# EasyEDA Pro project BSPD - 小板.eprj

# Schematic Sheet_1
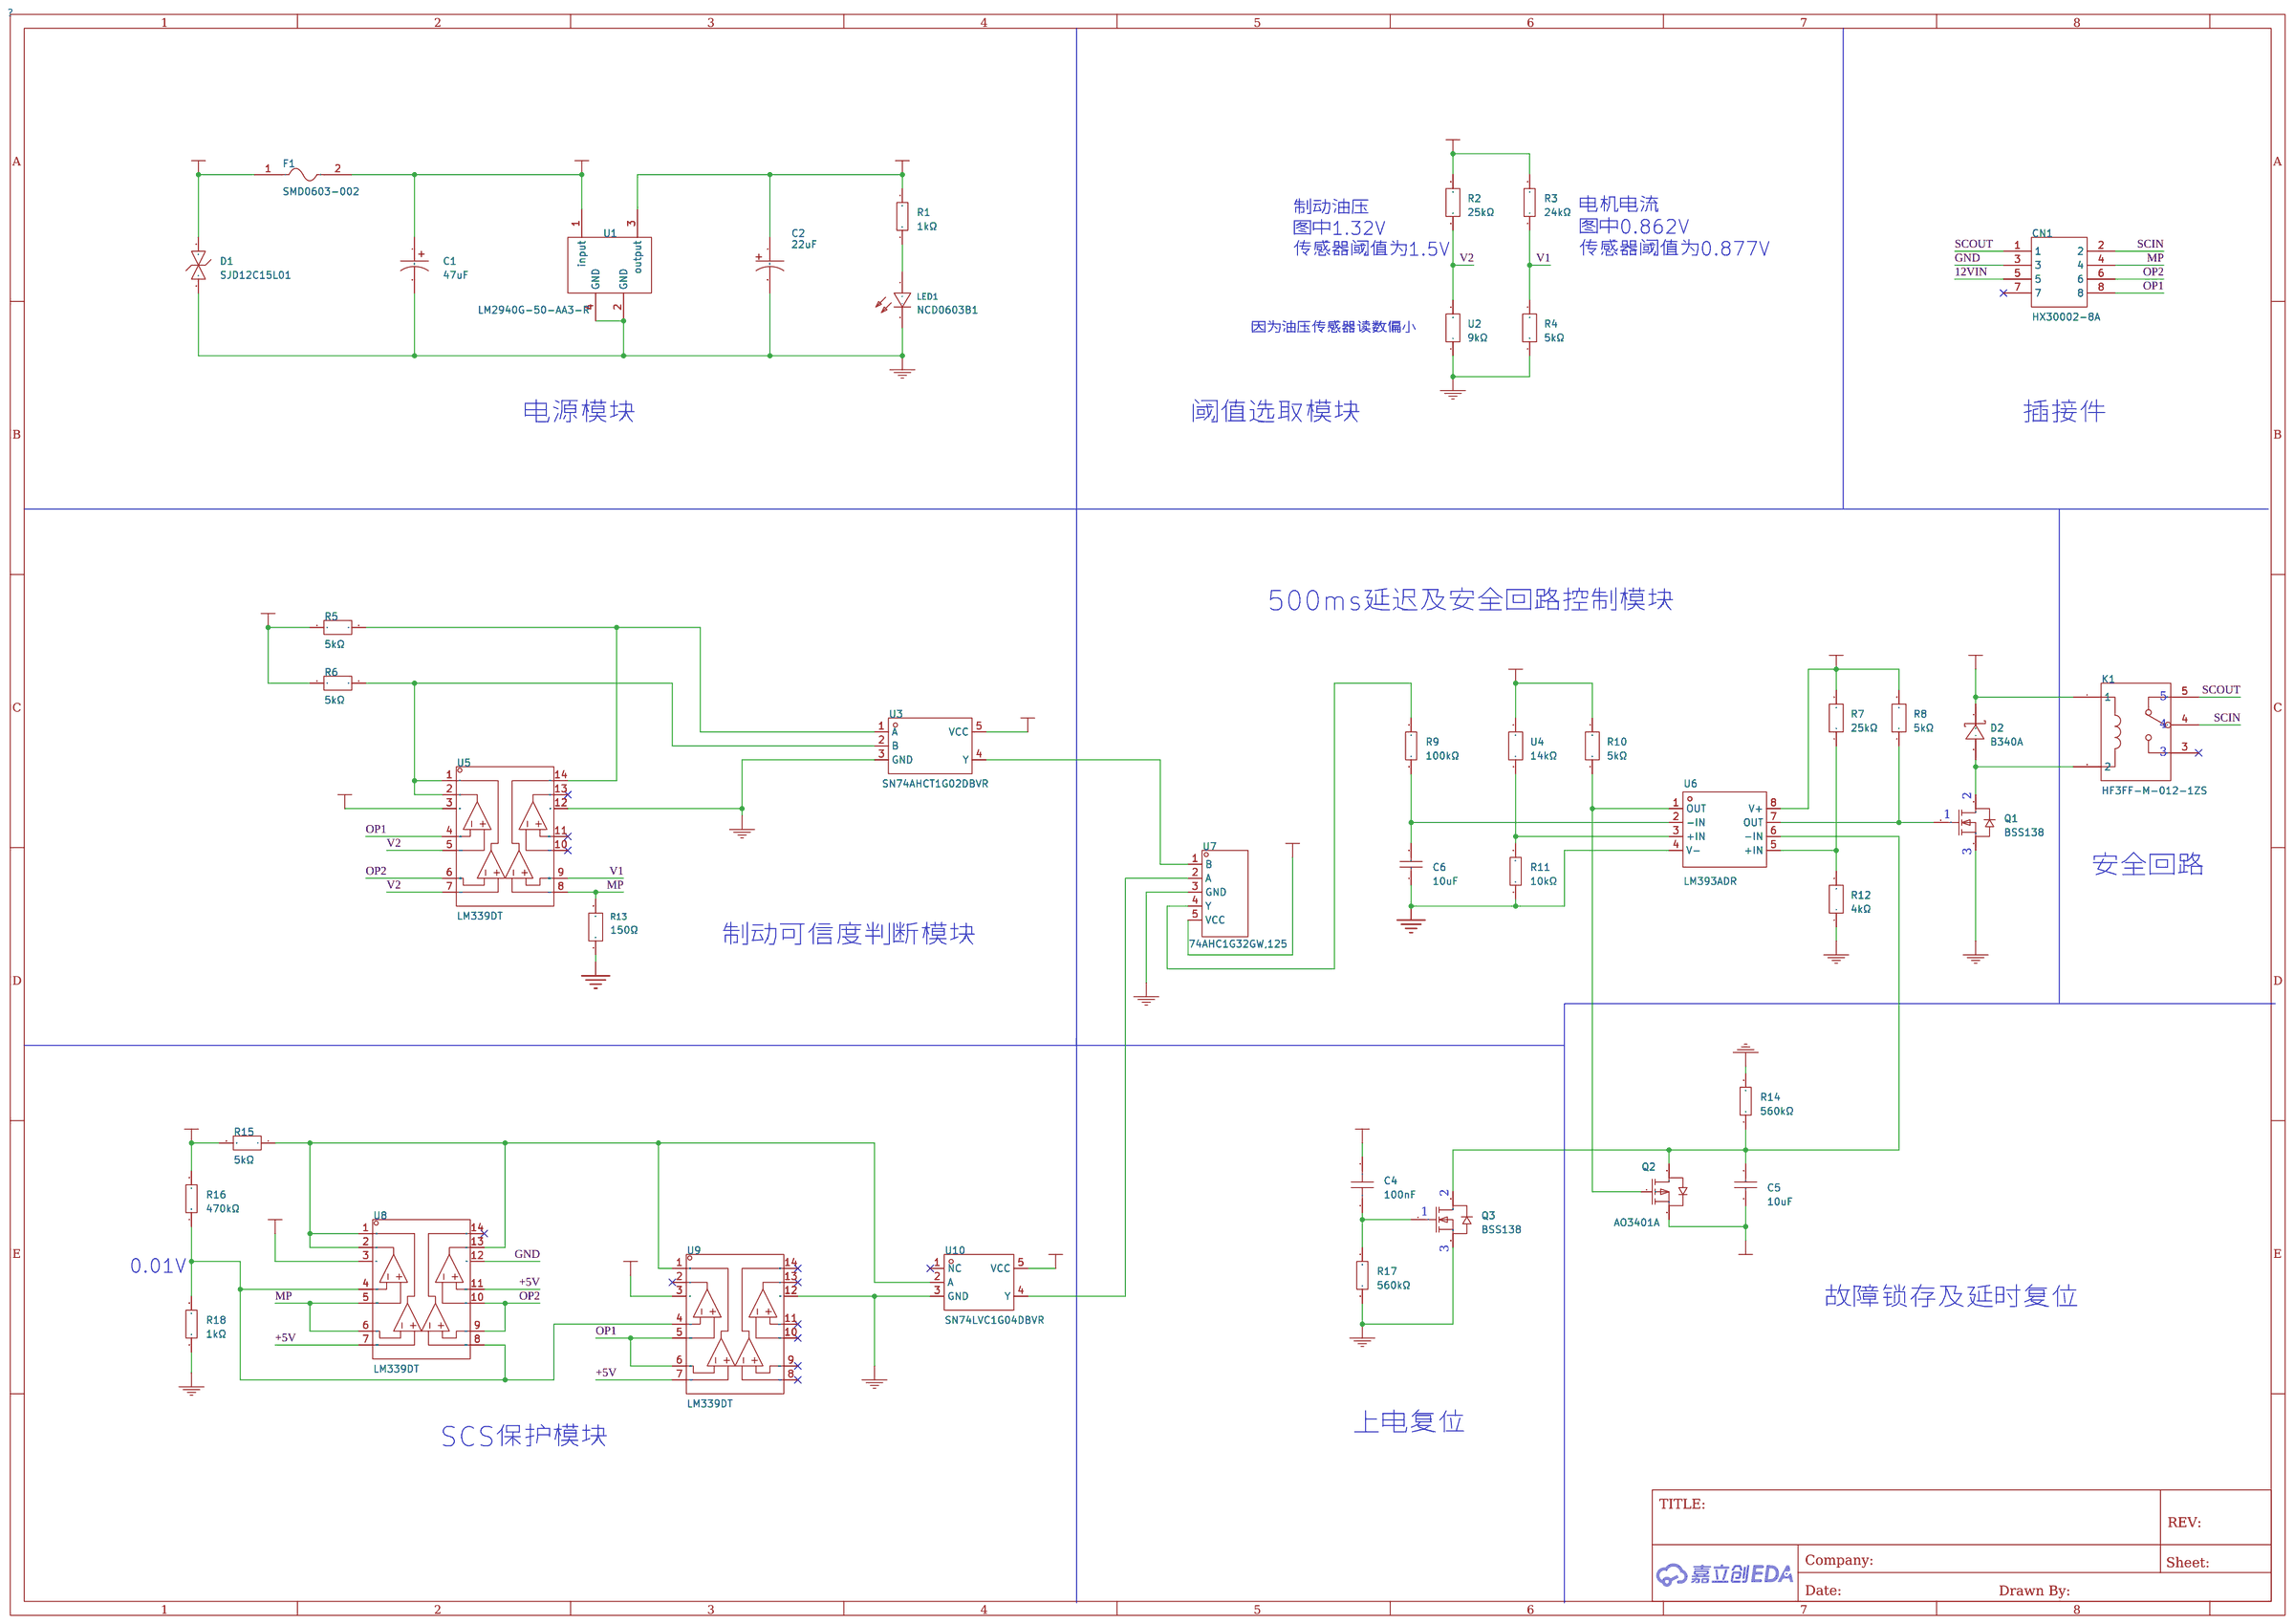
[diagram p0: schematic sheet]

## Parts
C1  47uF  [CAP-SMD_BD8.0-L8.3-W8.3-FD]
C2  22uF  [CAP-SMD_BD6.3-L6.6-W6.6-FD]
C4  100nF  [C0603]
C5  10uF  [C0805]
C6  10uF  [C0805]
CN1  HX30002-8A  [CONN-TH_30002-8A-T1P]
D1  SJD12C15L01  [SOD-123_L2.7-W1.6-LS3.7-BI]
D2  B340A  [SMA_L4.3-W2.6-LS5.1-RD]
F1  SMD0603-002  [F0603]
K1  HF3FF-M-012-1ZS  [RELAY-TH_HF3FF-XX-1ZXX-XXX]
LED1  NCD0603B1  [LED0603-RD]
Q1  BSS138  [SOT-23-3_L2.9-W1.3-P1.90-LS2.4-BR]
Q2  AO3401A  [SOT-23_L2.9-W1.3-P1.90-LS2.4-BR]
Q3  BSS138  [SOT-23-3_L2.9-W1.3-P1.90-LS2.4-BR]
R1  1kΩ  [R0603]
R2  25kΩ  [R0603]
R3  24kΩ  [R0603]
R4  5kΩ  [R0603]
R5  5kΩ  [R0603]
R6  5kΩ  [R0603]
R7  25kΩ  [R0603]
R8  5kΩ  [R0603]
R9  100kΩ  [R0603]
R10  5kΩ  [R0603]
R11  10kΩ  [R0603]
R12  4kΩ  [R0805]
R13  150Ω  [R0603]
R14  560kΩ  [R0603]
R15  5kΩ  [R0603]
R16  470kΩ  [R0603]
R17  560kΩ  [R0603]
R18  1kΩ  [R0603]
U1  LM2940G-50-AA3-R  [SOT-223-4_L6.5-W3.5-P2.30-LS7.0-BR]
U2  9kΩ  [R0805]
U3  SN74AHCT1G02DBVR  [SOT-23-5_L3.0-W1.7-P0.95-LS2.8-BR]
U4  14kΩ  [R0402]
U5  LM339DT  [SOIC-14_L8.7-W3.9-P1.27-LS6.0-BL]
U6  LM393ADR  [SOIC-8_L5.0-W4.0-P1.27-LS6.0-BL]
U7  74AHC1G32GW,125  [SOT-353-5_L2.0-W1.3-P0.65-LS2.1-BR]
U8  LM339DT  [SOIC-14_L8.7-W3.9-P1.27-LS6.0-BL]
U9  LM339DT  [SOIC-14_L8.7-W3.9-P1.27-LS6.0-BL]
U10  SN74LVC1G04DBVR  [SOT-23-5_L3.0-W1.7-P0.95-LS2.8-BR]

## Library data of the parts
C1 = HBW470M1JTR-0810: 容值:47uF;精度:±20%;额定电压:63V;; LCSC Part Name: 47uF ±20% 63V; Supplier Part: C3031616; Manufacturer: lelon(立隆); Supplier Footprint: SMD,D8xL10mm; JLCPCB Part Class: Extended Part; Datasheet: https://atta.szlcsc.com/upload/public/pdf/source/20220826/AE5C81AD789A3503116A80B6D4FBEF01.pdf; Supplier: LCSC; Tolerance: ±20%; Rated Voltage: 63V
C2 = EEHZA1J220XP: 容值:22uF;额定电压:63V;等效串联电阻:80mΩ 100kHz;纹波电流:1.5A 100kHz;工作温度:-55℃~+105℃;类型:-;电容体长度:7.7mm;精度:±20%;电容体直径:6.3mm;脚间距:-;工作寿命:10000hrs 105℃;; LCSC Part Name: 22uF 63V; Supplier Part: C454662; Manufacturer: PANASONIC(松下); Supplier Footprint: SMD,6.3x7.7mm; JLCPCB Part Class: Extended Part; Supplier: LCSC; Rated Voltage: 63V; Equivalent Series Resistance(ESR): 80mΩ 100kHz; Ripple Current: 1.5A 100kHz; Operating Temperature: -55℃~+105℃; L: 7.7mm; Tolerance: ±20%; φD: 6.3mm; Lifetime @ Temp: 10000hrs 105℃
C4 = CC0603KRX7R9BB104: 容值:100nF;精度:±10%;额定电压:50V;材质(温度系数):X7R;; LCSC Part Name: 100nF ±10% 50V; Supplier Part: C14663; Manufacturer: YAGEO(国巨); Supplier Footprint: 0603; JLCPCB Part Class: Basic Part; Datasheet: https://atta.szlcsc.com/upload/public/pdf/source/20180910/C282072_33301C7F631E79921B82A8DAC6BCC5B3.pdf; Supplier: LCSC; Tolerance: ±10%; Voltage Rated: 50V; Temperature Coefficient: X7R
C5 C6 = CL21A106KAYNNNE_C15850: 容值:10uF;精度:±10%;额定电压:25V;材质(温度系数):X5R;; LCSC Part Name: 10uF ±10% 25V; Supplier Part: C15850; Manufacturer: SAMSUNG(三星); Manufacturer Part: CL21A106KAYNNNE; Supplier Footprint: 0805; JLCPCB Part Class: Basic Part; Datasheet: https://atta.szlcsc.com/upload/public/pdf/source/20160103/1457707679302.pdf; Supplier: LCSC; Tolerance: ±10%; Voltage Rated: 25V; Temperature Coefficient: X5R
CN1 = HX30002-8A: 参考系列:-;间距:3mm;插针结构:2x4P;排数:2;每排PIN数:4;行距:3mm;安装方式:-;触头材质:黄铜;; LCSC Part Name: 3mm 2x4P; Supplier Part: C185091; Manufacturer: HX(红星); Supplier Footprint: 插件,P=3mm; JLCPCB Part Class: Extended Part; Datasheet: https://atta.szlcsc.com/upload/public/pdf/source/20180316/D977F4BC65FE6A384A4F595F180FB6F1.pdf; Supplier: LCSC; Pitch: 3mm; Pins Structure: 2x4P; Number of Rows: 2; Number of PINs Per Row: 4; Row Spacing: 3mm; Contact Material: 黄铜
D1 = SJD12C15L01: 反向截止电压(Vrwm):15V;击穿电压(VBR):16.7V;峰值脉冲电流(Ipp)@8/20us:8.2A;钳位电压(Vc)@Ipp:24.4V;; Supplier Part: C78437; Manufacturer: Brightking(君耀电子); Supplier Footprint: SOD-123; JLCPCB Part Class: Extended Part; Datasheet: https://atta.szlcsc.com/upload/public/pdf/source/20160709/1468031891025.pdf; Supplier: LCSC; Reverse Stand-Off Voltage (Vrwm): 15V; Breakdown Voltage (VBR): 16.7V; Peak Pulse Current(Ipp)@8/20us: 8.2A; Clamping Voltage@Ipp: 24.4V
D2 = B340A: 直流反向耐压(Vr):40V;平均整流电流(Io):3A;正向压降(Vf):550mV@3A;; LCSC Part Name: 40V 3A 550mV@3A; Supplier Part: C64982; Manufacturer: MDD; Supplier Footprint: SMA(DO-214AC); JLCPCB Part Class: Extended Part; Datasheet: https://atta.szlcsc.com/upload/public/pdf/source/20230314/FEC98C79C2B2FE8CB6E84FEE53FCCA40.pdf; Supplier: LCSC; Reverse Voltage (Vr): 40V; Average Rectified Current (Io): 3A; Forward Voltage (Vf@If): 550mV@3A
F1 = SMD0603-002: 30V,0.02A; LCSC Part Name: 20mA,30V; Supplier Part: C3646886; Manufacturer: 台湾陆海; Supplier Footprint: 0603; JLCPCB Part Class: Extended Part; Datasheet: https://atta.szlcsc.com/upload/public/pdf/source/20230404/20B4F423E9D21310C61C06C0FA62271A.pdf; Supplier: LCSC
K1 = HF3FF-M-012-1ZS: 引脚数:5;线圈电压:12V;触点形式:一组转换:1C(单刀双掷-转换);触点容量(电阻负载):-;触点材料:AgSnO2;; LCSC Part Name: 12V继电器 单刀双掷 停产; Supplier Part: C190459; Manufacturer: HF(宏发); Supplier Footprint: 插件,15.2x19mm; JLCPCB Part Class: Extended Part; Datasheet: https://atta.szlcsc.com/upload/public/pdf/source/20180404/C190459_D8DB0A982CC080BEC67C32A687C75363.pdf; Supplier: LCSC; Pin Number: 5; Coil Voltage: 12V; Coil Rated Power: 450mW; Contact Form: 一组转换:1C(单刀双掷-转换); Coil Resistance: 320Ω; Maximum Switching Current: 30V@DC; Maximum Switching Voltage: 15A; Operate Time: 10ms; Release Time: 10ms; Coil Type: 非极化-单线圈; Contact Resistance: 100mΩ; Contact Material: AgSnO2; Operating Temperature: -40℃~+85℃
LED1 = NCD0603B1: 发光颜色:蓝灯;; LCSC Part Name: 蓝灯; Supplier Part: C84266; Manufacturer: 国星光电; Supplier Footprint: 0603; JLCPCB Part Class: 扩展库; Datasheet: https://atta.szlcsc.com/upload/public/pdf/source/20200820/C84266_6A3CDBEFA72C6CAD68EDA53474ADAE6C.pdf; Supplier: LCSC; Emitted Color: 蓝灯
Q1 Q3 = BSS138_C78284: 类型:N沟道;漏源电压(Vdss):50V;连续漏极电流(Id):220mA;功率(Pd):360mW;导通电阻(RDS(on)@Vgs,Id):3.5Ω@10V,220mA;; LCSC Part Name: N沟道 50V 220mA; Supplier Part: C78284; Manufacturer: CJ(江苏长电/长晶); Supplier Footprint: SOT-23; JLCPCB Part Class: Extended Part; Datasheet: https://atta.szlcsc.com/upload/public/pdf/source/20160713/1468379865905.pdf; Supplier: LCSC; Type: N沟道; Drain Source Voltage (Vdss): 50V; Continuous Drain Current (Id): 220mA; Power Dissipation (Pd): 360mW; Drain Source On Resistance (RDS(on)@Vgs,Id): 3.5Ω@10V,220mA; Gate Threshold Voltage (Vgs(th)@Id): 1.5V@1mA
Q2 = AO3401A_C347476: Supplier Part: C347476; Manufacturer: UMW(广东友台半导体); Supplier Footprint: SOT-23; JLCPCB Part Class: Extended Part; Datasheet: https://atta.szlcsc.com/upload/public/pdf/source/20190827/C347476_6CCC01FEC3E3D166C83BA0E415FD2056.pdf; Supplier: LCSC
R1 R18 = 0603WAF1001T5E: 电阻类型:厚膜电阻;阻值:1kΩ;精度:±1%;功率:100mW;; LCSC Part Name: 1kΩ ±1% 100mW; Supplier Part: C21190; Manufacturer: UNI-ROYAL(厚声); Supplier Footprint: 0603; JLCPCB Part Class: Basic Part; Datasheet: https://atta.szlcsc.com/upload/public/pdf/source/20200306/C422600_1E6D84923E4A46A82E41ADD87F860B5C.pdf; Supplier: LCSC; Type: 厚膜电阻; Tolerance: ±1%; Power(Watts): 100mW; Temperature Coefficient: ±100ppm/℃; Overload Voltage (Max): 75V; Operating Temperature Range: -55℃~+155℃
R2 R7 = AR03BTCX2502: 电阻类型:薄膜电阻;阻值:25kΩ;精度:±0.1%;功率:100mW;; LCSC Part Name: 25kΩ ±0.1% 100mW; Supplier Part: C2828637; Manufacturer: Viking(光颉); Supplier Footprint: 0603; JLCPCB Part Class: Extended Part; Datasheet: https://atta.szlcsc.com/upload/public/pdf/source/20211009/C2828637_E2017FEC9B0D6FD586360A50ABE90B69.pdf; Supplier: LCSC; Type: 薄膜电阻; Tolerance: ±0.1%; Power(Watts): 100mW; Temperature Coefficient: ±25ppm/℃; Overload Voltage (Max): 50V; Operating Temperature Range: -55℃~+155℃
R3 = 0603WAF2402T5E: 电阻类型:厚膜电阻;阻值:24kΩ;精度:±1%;功率:100mW;温度系数:±100ppm/℃;; LCSC Part Name: 厚膜电阻 24kΩ ±1% 100mW; Supplier Part: C23352; Manufacturer: UNI-ROYAL(厚声); Supplier Footprint: 0603; JLCPCB Part Class: 基础库; Datasheet: https://atta.szlcsc.com/upload/public/pdf/source/20200306/C422600_1E6D84923E4A46A82E41ADD87F860B5C.pdf; Supplier: LCSC; Type: 厚膜电阻; Tolerance: ±1%; Power(Watts): 100mW; Temperature Coefficient: ±100ppm/℃; Overload Voltage (Max): 75V; Operating Temperature Range: -55℃~+155℃
R4-R6 R8 R10 R15 = AR03BTCX5001: 电阻类型:薄膜电阻;阻值:5kΩ;精度:±0.1%;功率:100mW;; LCSC Part Name: 5kΩ ±0.1% 100mW; Supplier Part: C2828621; Manufacturer: Viking(光颉); Supplier Footprint: 0603; JLCPCB Part Class: Extended Part; Datasheet: https://atta.szlcsc.com/upload/public/pdf/source/20211009/C2828621_7F88408CB1D09DFC08036051E0A6050B.pdf; Supplier: LCSC; Type: 薄膜电阻; Tolerance: ±0.1%; Power(Watts): 100mW; Temperature Coefficient: ±25ppm/℃; Overload Voltage (Max): 50V; Operating Temperature Range: -55℃~+155℃
R9 = 0603WAF1003T5E: 电阻类型:厚膜电阻;阻值:100kΩ;精度:±1%;功率:100mW;; LCSC Part Name: 100kΩ ±1% 100mW; Supplier Part: C25803; Manufacturer: UNI-ROYAL(厚声); Supplier Footprint: 0603; JLCPCB Part Class: Basic Part; Datasheet: https://atta.szlcsc.com/upload/public/pdf/source/20200306/C422600_1E6D84923E4A46A82E41ADD87F860B5C.pdf; Supplier: LCSC; Type: 厚膜电阻; Tolerance: ±1%; Power(Watts): 100mW; Temperature Coefficient: ±100ppm/℃; Overload Voltage (Max): 75V; Operating Temperature Range: -55℃~+155℃
R11 = 0603WAF1002T5E: 电阻类型:厚膜电阻;阻值:10kΩ;精度:±1%;功率:100mW;; LCSC Part Name: 厚膜电阻 10kΩ ±1% 100mW; Supplier Part: C25804; Manufacturer: UNI-ROYAL(厚声); Supplier Footprint: 0603; JLCPCB Part Class: Basic Part; Datasheet: https://atta.szlcsc.com/upload/public/pdf/source/20200306/C422600_1E6D84923E4A46A82E41ADD87F860B5C.pdf; Supplier: LCSC; Type: 厚膜电阻; Tolerance: ±1%; Power(Watts): 100mW; Temperature Coefficient: ±100ppm/℃; Overload Voltage (Max): 75V; Operating Temperature Range: -55℃~+155℃
R12 = ARG05FTC4001N: 电阻类型:薄膜电阻;阻值:4kΩ;精度:±1%;功率:125mW;; LCSC Part Name: 4kΩ ±1% 125mW; Supplier Part: C2828855; Manufacturer: Viking(光颉); Supplier Footprint: 0805; JLCPCB Part Class: Extended Part; Datasheet: https://atta.szlcsc.com/upload/public/pdf/source/20211009/C2828855_D9C62846AF9CFE91EEAE1DDE47EE8653.pdf; Supplier: LCSC; Type: 薄膜电阻; Tolerance: ±1%; Power(Watts): 125mW; Temperature Coefficient: ±25ppm/℃; Overload Voltage (Max): 150V; Operating Temperature Range: -55℃~+155℃
R13 = PTFR0603B150RN9: 电阻类型:薄膜电阻;阻值:150Ω;精度:±0.1%;功率:100mW;温度系数:±10ppm/℃;; LCSC Part Name: 薄膜电阻 150Ω ±0.1% 100mW; Supplier Part: C2692872; Manufacturer: RESI(开步睿思）; Supplier Footprint: 0603; JLCPCB Part Class: Extended Part; Datasheet: https://atta.szlcsc.com/upload/public/pdf/source/20210312/C2692860_0B6649DBA3C867366D8AF92C78953B08.pdf; Supplier: LCSC; Type: 薄膜电阻; Tolerance: ±0.1%; Power(Watts): 100mW; Temperature Coefficient: ±10ppm/℃; Overload Voltage (Max): 100V; Operating Temperature Range: -55℃~+125℃
R14 R17 = 0603WAF5603T5E: 电阻类型:厚膜电阻;阻值:560kΩ;精度:±1%;功率:100mW;; LCSC Part Name: 560kΩ ±1% 100mW; Supplier Part: C23203; Manufacturer: UNI-ROYAL(厚声); Supplier Footprint: 0603; JLCPCB Part Class: Basic Part; Datasheet: https://atta.szlcsc.com/upload/public/pdf/source/20200306/C422600_1E6D84923E4A46A82E41ADD87F860B5C.pdf; Supplier: LCSC; Type: 厚膜电阻; Tolerance: ±1%; Power(Watts): 100mW; Temperature Coefficient: ±100ppm/℃; Overload Voltage (Max): 75V; Operating Temperature Range: -55℃~+155℃
R16 = 0603WAF4703T5E: 电阻类型:厚膜电阻;阻值:470kΩ;精度:±1%;功率:100mW;; LCSC Part Name: 470kΩ ±1% 100mW; Supplier Part: C23178; Manufacturer: UNI-ROYAL(厚声); Supplier Footprint: 0603; JLCPCB Part Class: 基础库; Datasheet: https://atta.szlcsc.com/upload/public/pdf/source/20200306/C422600_1E6D84923E4A46A82E41ADD87F860B5C.pdf; Supplier: LCSC; Type: 厚膜电阻; Tolerance: ±1%; Power(Watts): 100mW; Temperature Coefficient: ±100ppm/℃; Overload Voltage (Max): 75V; Operating Temperature Range: -55℃~+155℃
U1 = LM2940G-50-AA3-R: 输出类型:固定;输出极性:正;输出通道数:1;最大输入电压:26V;输出电压:5V;压差:800mV@(1A);输出电流:1A;电源纹波抑制比(PSRR):72dB@(120Hz);; LCSC Part Name: 正 Vin=26V Vout=5V 1A 72dB@(120Hz); Supplier Part: C71094; Manufacturer: UTC(友顺); Supplier Footprint: SOT-223-4; JLCPCB Part Class: Extended Part; Datasheet: https://atta.szlcsc.com/upload/public/pdf/source/20160416/1460799393051.pdf; Supplier: LCSC; Output Type: 固定; Output Polarity: 正; Number of Outputs: 1; Maximum Input Voltage: 26V; Output Voltage: 5V; Dropout Voltage: 800mV@(1A); Output Current: 1A; Power Supply Rejection Ratio (PSRR): 72dB@(120Hz)
U2 = ARG05BTC9001N: 电阻类型:薄膜电阻;阻值:9kΩ;精度:±0.1%;功率:125mW;; LCSC Part Name: 9kΩ ±0.1% 125mW; Supplier Part: C2828721; Manufacturer: Viking(光颉); Supplier Footprint: 0805; JLCPCB Part Class: Extended Part; Datasheet: https://atta.szlcsc.com/upload/public/pdf/source/20211009/C2828721_BEDCD57BD0F711BBAFC7B17F6BE665AD.pdf; Supplier: LCSC; Type: 薄膜电阻; Tolerance: ±0.1%; Power(Watts): 125mW; Temperature Coefficient: ±25ppm/℃; Overload Voltage (Max): 150V; Operating Temperature Range: -55℃~+155℃
U3 = SN74AHCT1G02DBVR: 逻辑电路的归属系列:74AHCT;逻辑类型:或非门;; LCSC Part Name: 或非门; Supplier Part: C163710; Manufacturer: TI(德州仪器); Supplier Footprint: SOT-23-5; JLCPCB Part Class: Extended Part; Datasheet: https://atta.szlcsc.com/upload/public/pdf/source/20180329/C163710_AF396B66C9170E2FC25D4E514CBC82E3.pdf; Supplier: LCSC; Series: 74AHCT; Logic Gate Type: 或非门
U4 = SCR0402F14K: 阻值:14kΩ;精度:±1%;; LCSC Part Name: 14kΩ ±1%; Supplier Part: C3015834; Manufacturer: VO(翔胜); Supplier Footprint: 0402; JLCPCB Part Class: Extended Part; Datasheet: https://atta.szlcsc.com/upload/public/pdf/source/20220513/247AF9639BA21CF93567DC289CCC6A22.pdf; Supplier: LCSC; Tolerance: ±1%
U5 U8 U9 = LM339DT: 比较器组数:4;电源电压:2V ~ 32V, ±1V ~ 16V;各通道供电电流:2.5mA;输出类型:CMOS, DTL, ECL, MOS, Open-Collector, TTL;传播延迟:-;; Supplier Part: C71036; Manufacturer: ST(意法半导体); Supplier Footprint: SO14; JLCPCB Part Class: Extended Part; Datasheet: https://atta.szlcsc.com/upload/public/pdf/source/20160408/1460100649765.pdf; Supplier: LCSC; Number of Elements: 4; Supply Voltage（Single）: 2V ~ 32V, ±1V ~ 16V; Iq per channel (Typ): 2.5mA; Output Type: CMOS, DTL, ECL, MOS, Open-Collector, TTL; Operating Temperature: 0°C ~ 70°C
U6 = LM393ADR_C30394: 比较器组数:2;电源电压:2V~36V,±1V~18V;各通道供电电流:2.5mA;输出类型:CMOS, MOS, Open-Collector, TTL;传播延迟:-;; Supplier Part: C30394; Manufacturer: TI(德州仪器); Supplier Footprint: SOIC-8-150mil; JLCPCB Part Class: Extended Part; Datasheet: https://atta.szlcsc.com/upload/public/pdf/source/20140425/1457707046713.pdf; Supplier: LCSC; Number of Elements: 2; Supply Voltage（Single）: 2V~36V,±1V~18V; Iq per channel (Typ): 2.5mA; Output Type: CMOS, MOS, Open-Collector, TTL; Operating Temperature: 0°C ~ 70°C
U7 = 74AHC1G32GW,125: 逻辑类型:或门;通道数:1;电源电压:2V~5.5V;静态电流(最大值):1uA;最大传播延迟:7.5ns@5V,50pF;; LCSC Part Name: 或门; Supplier Part: C12489; Manufacturer: Nexperia(安世); Supplier Footprint: SOT-353; JLCPCB Part Class: Extended Part; Datasheet: https://atta.szlcsc.com/upload/public/pdf/source/20220815/B1BE7544FCE627AC6685637B8BBDD300.pdf; Supplier: LCSC; Series: 74AHC; Logic Gate Type: 或门; Number of Channels: 1; Supply Voltage: 2V~5.5V; Quiescent Current (Max): 1uA; Sink Current: 8mA; Source Current: 8mA; High Level Range (VIH): 1.5V~3.85V; Low Level Range (VIL): 500mV~1.65V; Propagation Delay Time: 7.5ns@5V,50pF; Operating Temperature: -40℃~+125℃
U10 = SN74LVC1G04DBVR: LCSC Part Name: 门极和反相器; Supplier Part: C434067; Manufacturer: UMW(广东友台半导体); Supplier Footprint: SOT-23-5; JLCPCB Part Class: Extended Part; Datasheet: https://atta.szlcsc.com/upload/public/pdf/source/20190930/C434067_C317521F7851E57339C1FB91FCB4BA19.pdf; Supplier: LCSC

## Nets
12VIN: CN1.5 D1.2 F1.1
+5V: C2.1 C4.2 C5.1 Q2.2(S) R1.2 R2.2 R3.2 R5.2 R6.2 R7.2 R8.2 R10.2 R15.2 R16.2 U1.3(output) U3.5(VCC) U4.2 U5.3(VDD) U6.8(V+) U7.5(VCC) U8.3(VDD) U8.7(Non-inverting input2) U8.11(Non-inverting input4) U9.3(VDD) U9.7(Non-inverting input2) U10.5(VCC)
+12V: C1.1 D2.1(K) F1.2 K1.1 U1.1(input)
GND: C1.2 C2.2 C6.1 CN1.3 D1.1 LED1.1(-) Q1.2(S) Q3.2(S) R4.2 R11.1 R12.1 R13.1 R14.2 R17.1 R18.1 U1.2(GND) U1.4(GND) U2.1 U3.3(GND) U5.12(GND) U6.4(V-) U7.3(GND) U8.12(GND) U9.12(GND) U10.3(GND)
V1: R3.1 R4.1 U5.9(Non-inverting input3)
V2: R2.1 U2.2 U5.5(Non-inverting input1) U5.7(Non-inverting input2)
MP: CN1.4 R13.2 U5.8(Inverting input3) U8.5(Non-inverting input1) U8.6(Inverting input2)
OP1: CN1.8 U5.4(Inverting input1) U9.5(Non-inverting input1) U9.6(Inverting input2)
OP2: CN1.6 U5.6(Inverting input2) U8.9(Non-inverting input3) U8.10(Inverting input4)
SCIN: CN1.2 K1.4
SCOUT: CN1.1 K1.5
$1N80: LED1.2(+) R1.1
$1N251: R6.1 U3.2(B) U5.1(OUTPUT2) U5.2(OUTPUT1)
$1N317: U7.2(A) U10.4(Y)
$1N570: D2.2(A) K1.2 Q1.3(D)
$1N660: C4.1 Q3.1(G) R17.2
$1N1894: R5.1 U3.1(A) U5.14(OUTPUT3)
$1N2001: U3.4(Y) U7.1(B)
$1N4280: Q1.1(G) R8.1 U6.7(OUT)
$1N5487: R11.2 U4.1 U6.3(+IN)
$1N7549: R7.1 R12.2 U6.5(+IN)
$1N7655: Q2.1(G) R10.1 U6.1(OUT)
$1N14250: R15.1 U8.1(OUTPUT2) U8.2(OUTPUT1) U8.13(OUTPUT4) U9.1(OUTPUT2) U10.2(A)
$1N14254: R9.2 U7.4(Y)
$1N35655: R16.1 R18.2 U8.4(Inverting input1) U8.8(Inverting input3) U9.4(Inverting input1)
$1N35960: C5.2 Q2.3(D) Q3.3(D) R14.1 U6.6(-IN)
$1N36060: C6.2 R9.1 U6.2(-IN)

Not connected (* = marked no-connect by the designer): CN1 7*; K1 3*; U5 10(Inverting input4)* 11(Non-inverting input4)* 13(OUTPUT4)*; U8 14(OUTPUT3)*; U9 2(OUTPUT1)* 8(Inverting input3)* 9(Non-inverting input3)* 10(Inverting input4)* 11(Non-inverting input4)* 13(OUTPUT4)* 14(OUTPUT3)*; U10 1(NC)*

## Notes on the sheet
- 制动油压
  图中1.32V
  传感器阈值为1.5V
- 电机电流
  图中0.862V
  传感器阈值为0.877V
- 因为油压传感器读数偏小
- 电源模块
- 阈值选取模块
- 插接件
- 500ms延迟及安全回路控制模块
- 5
- 4
- 3
- 2
- 1
- 3
- 安全回路
- 制动可信度判断模块
- 2
- 1
- 3
- 0.01V
- 故障锁存及延时复位
- 上电复位
- SCS保护模块

# Board PCB1
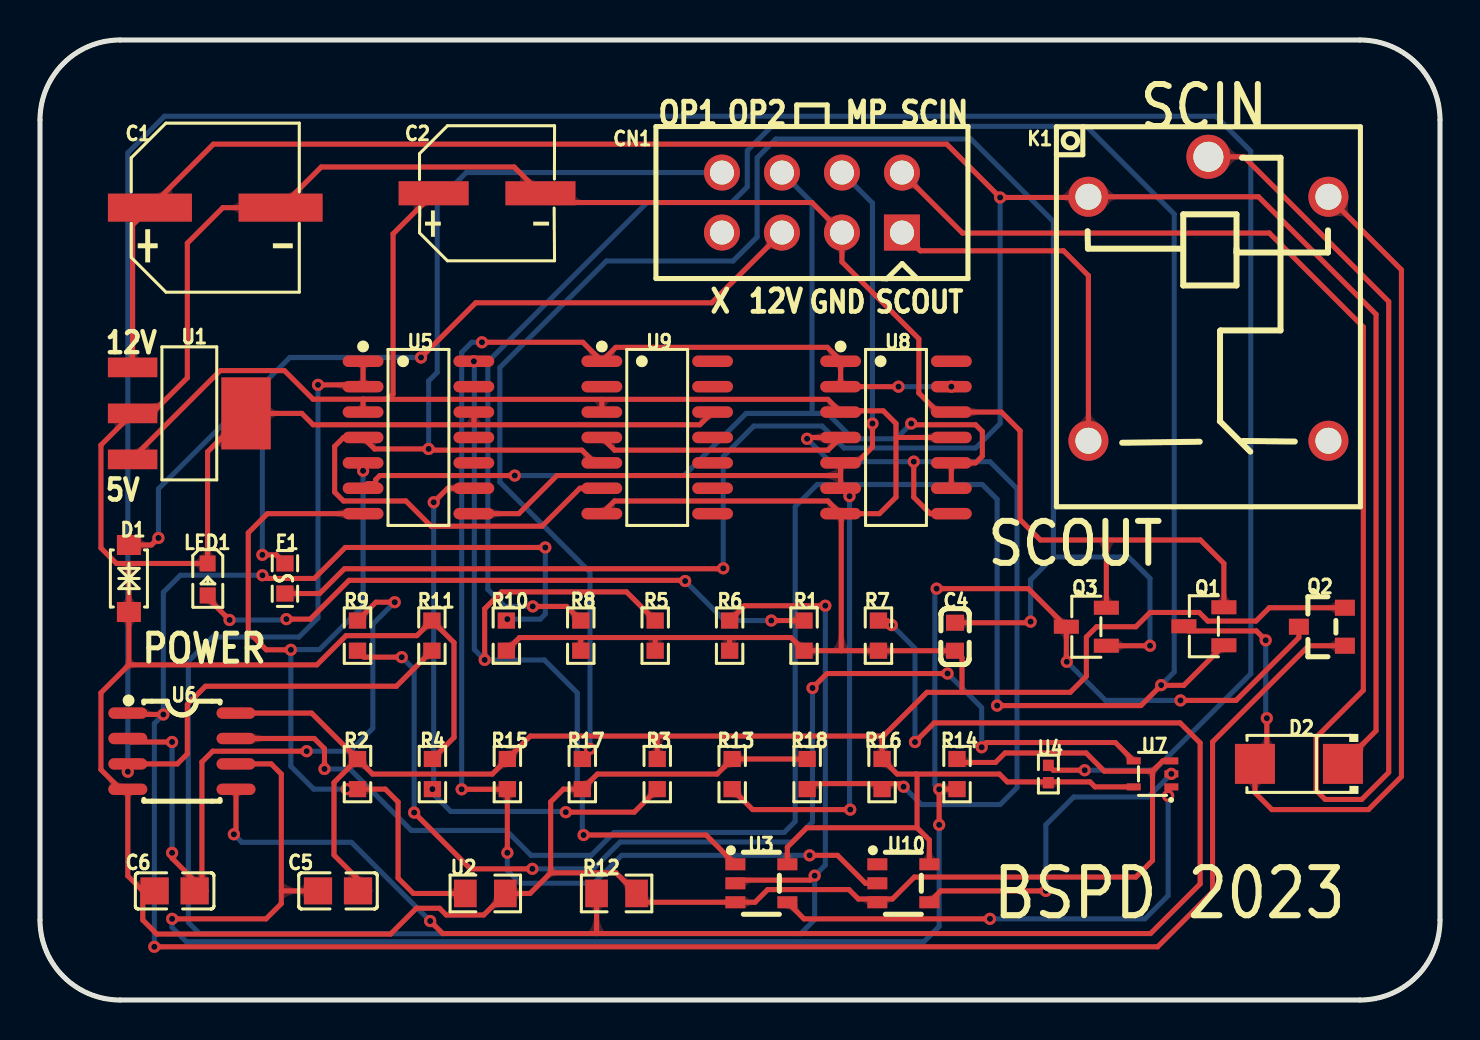
[diagram p1: board, top side]
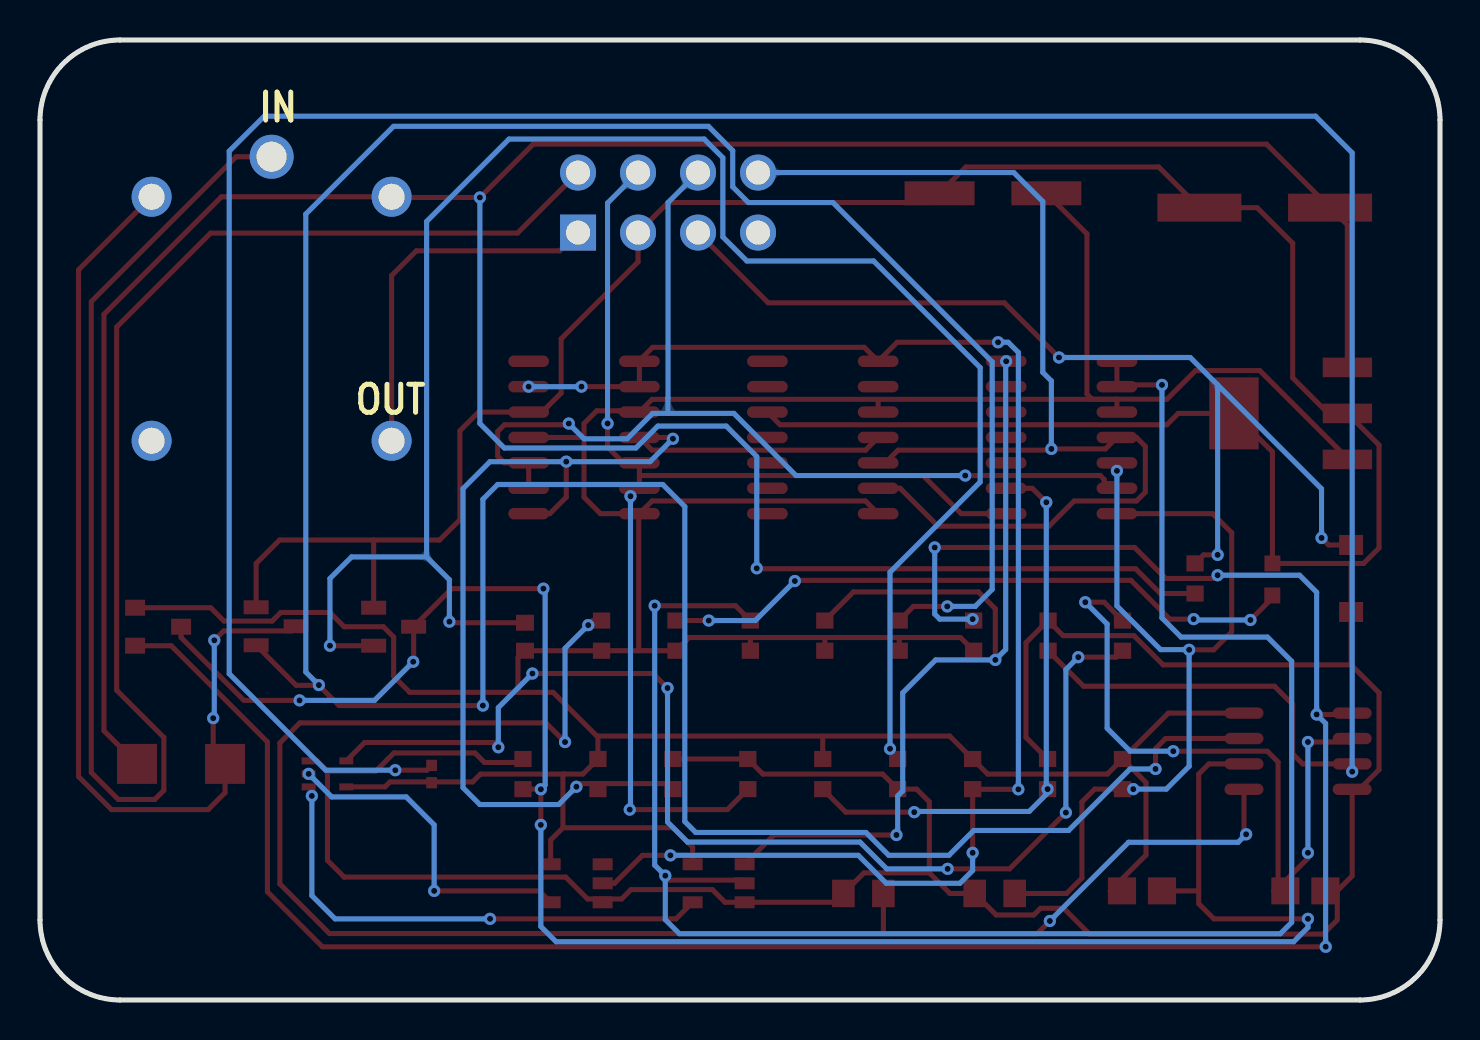
[diagram p2: board, bottom side, seen from below]

Outline 70 x 48 mm; copper layers: Top Layer, Bottom Layer. Coordinates in mm from the lower left corner of the outline.
Outline path: 0,44 0,4 arc(1.17,1.17) 4,0 66,0 arc(68.83,1.17) 70,4 70,44 arc(68.83,46.83) 66,48 4,48 arc(1.17,46.83) 0,44
Stack: Top Layer 0.035mm / Dielectric1 1.51mm FR4 er 4.5 / Bottom Layer 0.035mm

## Design rules (mm)
template: JLCPCB Capability(Two Layers Board)
spacing copperThickness1oz (default): track to track 0.102, other pairs 0.152 to 0.3
spacing copperThickness2oz: track to track 0.203, other pairs 0.152 to 0.3
track width copperThickness1oz (default): min 0.127, default 0.254, max 2.54
track width copperThickness2oz: min 0.203, default 0.254, max 2.54
differential pair differentialPair (default): width min 0.127, default 0.254, max 2.54; gap min 0.152, default 0.152
via viaSize (default): diameter min 0.5, default 0.61, max 10; hole min 0.3, default 0.305, max 6.3

## Placement (name value [footprint] x y rotation side)
C1  47uF  [CAP-SMD_BD8.0-L8.3-W8.3-FD]  8.76 39.62 0 top
C2  22uF  [CAP-SMD_BD6.3-L6.6-W6.6-FD]  22.35 40.34 0 top
C4  100nF  [C0603]  45.75 18.16 270 top
C5  10uF  [C0805]  14.9 5.45 180 top
C6  10uF  [C0805]  6.73 5.45 0 top
CN1  HX30002-8A  [CONN-TH_30002-8A-T1P]  38.6 39.87 180 top
D1  SJD12C15L01  [SOD-123_L2.7-W1.6-LS3.7-BI]  4.44 21.08 90 top
D2  B340A  [SMA_L4.3-W2.6-LS5.1-RD]  62.95 11.81 180 top
F1  SMD0603-002  [F0603]  12.25 21.08 270 top
K1  HF3FF-M-012-1ZS  [RELAY-TH_HF3FF-XX-1ZXX-XXX]  58.42 35.06 270 top
LED1  NCD0603B1  [LED0603-RD]  8.38 21.03 270 top
Q1  BSS138  [SOT-23-3_L2.9-W1.3-P1.90-LS2.4-BR]  58.19 18.69 0 top
Q2  AO3401A  [SOT-23_L2.9-W1.3-P1.90-LS2.4-BR]  64.09 18.66 0 top
Q3  BSS138  [SOT-23-3_L2.9-W1.3-P1.90-LS2.4-BR]  52.32 18.66 0 top
R1  1kΩ  [R0603]  38.2 18.22 270 top
R2  25kΩ  [R0603]  15.88 11.3 90 top
R3  24kΩ  [R0603]  30.86 11.3 90 top
R4  5kΩ  [R0603]  19.62 11.3 90 top
R5  5kΩ  [R0603]  30.76 18.22 270 top
R6  5kΩ  [R0603]  34.48 18.22 270 top
R7  25kΩ  [R0603]  41.92 18.22 270 top
R8  5kΩ  [R0603]  27.04 18.22 270 top
R9  100kΩ  [R0603]  15.88 18.22 270 top
R10  5kΩ  [R0603]  23.32 18.22 270 top
R11  10kΩ  [R0603]  19.6 18.22 270 top
R12  4kΩ  [R0805]  28.83 5.33 180 top
R13  150Ω  [R0603]  34.61 11.3 270 top
R14  560kΩ  [R0603]  45.85 11.3 90 top
R15  5kΩ  [R0603]  23.37 11.3 90 top
R16  470kΩ  [R0603]  42.1 11.3 90 top
R17  560kΩ  [R0603]  27.12 11.3 90 top
R18  1kΩ  [R0603]  38.36 11.3 270 top
U1  LM2940G-50-AA3-R  [SOT-223-4_L6.5-W3.5-P2.30-LS7.0-BR]  7.47 29.33 180 top
U2  9kΩ  [R0805]  22.27 5.33 180 top
U3  SN74AHCT1G02DBVR  [SOT-23-5_L3.0-W1.7-P0.95-LS2.8-BR]  36.07 5.84 180 top
U4  14kΩ  [R0402]  50.42 11.3 270 top
U5  LM339DT  [SOIC-14_L8.7-W3.9-P1.27-LS6.0-BL]  18.92 28.13 270 top
U6  LM393ADR  [SOIC-8_L5.0-W4.0-P1.27-LS6.0-BL]  7.1 12.44 270 top
U7  74AHC1G32GW,125  [SOT-353-5_L2.0-W1.3-P0.65-LS2.1-BR]  55.63 11.31 0 top
U8  LM339DT  [SOIC-14_L8.7-W3.9-P1.27-LS6.0-BL]  42.8 28.13 270 top
U9  LM339DT  [SOIC-14_L8.7-W3.9-P1.27-LS6.0-BL]  30.86 28.13 270 top
U10  SN74LVC1G04DBVR  [SOT-23-5_L3.0-W1.7-P0.95-LS2.8-BR]  43.17 5.84 180 top

## Footprints (pads in the part's own frame, mm; a bottom-side part is the same pattern mirrored in y, then rotated)
C0603
  rect 0.8x0.9 smd: 1(-0.7,0) 2(0.7,0)
C0805
  rect 1.41x1.35 smd: 1(-1,0) 2(1,0)
CAP-SMD_BD6.3-L6.6-W6.6-FD
  rect 3.5x1.2 smd: 1(-2.67,0) 2(2.67,0)
CAP-SMD_BD8.0-L8.3-W8.3-FD
  rect 4.2x1.4 smd: 1(-3.267,0) 2(3.267,0)
CONN-TH_30002-8A-T1P
  rect 1.8x1.8 hole 1.2: 1(-4.5,1.5)
  round 1.8 hole 1.2: 2(-4.5,-1.5) 3(-1.5,1.5) 4(-1.5,-1.5) 5(1.5,1.5) 6(1.5,-1.5) 7(4.5,1.5) 8(4.5,-1.5)
F0603
  rect 0.806x0.864 smd: 1(-0.753,0) 2(0.753,0)
LED0603-RD
  rect 0.8x0.8 smd: 1(-0.799,-0.004) 2(0.799,0.004)
R0402
  rect 0.566x0.54 smd: 1(-0.433,0) 2(0.433,0)
R0603
  rect 0.806x0.864 smd: 1(-0.753,0) 2(0.753,0)
R0805
  rect 1.133x1.377 smd: 1(-1,0) 2(1,0)
RELAY-TH_HF3FF-XX-1ZXX-XXX
  round 2 hole 1.3: 1(-5.1,-6) 2(-5.1,6) 3(7.1,6) 5(7.1,-6)
  round 2.2 hole 1.5: 4(-7.1,0)
SMA_L4.3-W2.6-LS5.1-RD
  rect 2x2 smd: 1(-2.2,0) 2(2.2,0)
SOD-123_L2.7-W1.6-LS3.7-BI
  rect 1x1.2 smd: 1(-1.675,0) 2(1.675,0)
SOIC-8_L5.0-W4.0-P1.27-LS6.0-BL
  oval 0.569x1.95 smd: 1(-1.905,-2.705) 2(-0.635,-2.705) 3(0.635,-2.705) 4(1.905,-2.705) 5(1.905,2.705) 6(0.635,2.705) 7(-0.635,2.705) 8(-1.905,2.705)
SOIC-14_L8.7-W3.9-P1.27-LS6.0-BL
  oval 0.574x2.038 smd: 1(-3.81,-2.769) 2(-2.54,-2.769) 3(-1.27,-2.769) 4(0,-2.769) 5(1.27,-2.769) 6(2.54,-2.769) 7(3.81,-2.769) 8(3.81,2.769) 9(2.54,2.769) 10(1.27,2.769) 11(0,2.769) 12(-1.27,2.769) 13(-2.54,2.769) 14(-3.81,2.769)
SOT-23-3_L2.9-W1.3-P1.90-LS2.4-BR
  rect 1.25x0.7 smd: 1(1,-0.95) 2(1,0.95) 3(-1,0)
SOT-23-5_L3.0-W1.7-P0.95-LS2.8-BR
  rect 1x0.6 smd: 1(1.3,-0.95) 2(1.3,0) 3(1.3,0.95) 4(-1.3,0.95) 5(-1.3,-0.95)
SOT-23_L2.9-W1.3-P1.90-LS2.4-BR
  rect 1x0.8 smd: 1(1.15,-0.95) 2(1.15,0.95) 3(-1.15,0)
SOT-223-4_L6.5-W3.5-P2.30-LS7.0-BR
  rect 2.47x0.98 smd: 1(2.835,-2.3) 2(2.835,0) 3(2.835,2.3)
  rect 2.47x3.6 smd: 4(-2.835,0)
SOT-353-5_L2.0-W1.3-P0.65-LS2.1-BR
  rect 0.7x0.35 smd: 1(0.94,-0.65) 2(0.94,0) 3(0.94,0.65) 4(-0.94,0.65) 5(-0.94,-0.65)

## Nets
As in the schematic.

Pads without a net: CN1 7; K1 3; U5 10 11 13; U8 14; U9 2 8 9 10 11 13 14; U10 1

## Via types
v1: diameter 0.61, hole 0.305, Top Layer to Bottom Layer, 76 vias

## Routing (per net, layer and track width the routed paths; a pad name or vN(x,y) marks a point on that pad's centre or on a via; arc(x,y) is an arc through that point)
12VIN: length 50.4
  Top Layer w0.254: CN1.5 33.58,34.86 21.78,34.86 v1(19.05,32.12) ; v1(5.92,23.1) 5.57,22.75 4.44,22.75 ; v1(11.12,22.26) 11.82,22.26 F1.1
  Bottom Layer w0.254: v1(5.92,23.1) 5.92,25.56 11.12,30.76 ; 11.12,30.76 12.49,32.12 v1(19.05,32.12) ; 11.12,30.76 v1(11.12,22.26)
+5V: length 208.5
  Top Layer w0.254: 42.8,28.13 U8.11 ; 42.8,28.13 42.8,25.14 41.98,24.32 40.06,24.32 ; 42.8,28.13 42.8,28.82 42.16,29.46 41.02,29.46 40.96,29.4 U8.3 39.4,30.03 28.09,30.03 ; U7.5 52.75,10.66 52.5,10.91 48.37,10.91 47.97,11.3 43.81,11.3 ; 16.15,30.04 13.65,30.04 12.22,31.47 9.01,31.47 4.63,27.09 4.63,27.03 ; 16.15,30.04 16.15,30.03 ; 16.15,30.04 17.4,30.04 17.65,30.29 17.65,38.31 C2.1 ; R2.2 16.63,11.3 22.62,11.3 R15.2 24.51,13.2 42.1,13.2 42.1,13.14 ; R2.2 13.58,14.34 U6.8 ; R2.2 14.7,10.88 14.7,7.25 16.49,5.45 ; 43.81,11.3 42.86,11.3 R16.2 42.1,13.14 ; 43.81,11.3 43.82,11.29 43.83,11.29 43.85,11.26 43.85,8.61 ; 30.76,18.12 34.48,18.12 ; 30.76,18.12 R5.2 ; 30.76,18.12 27.04,18.12 ; 34.48,18.12 37.54,18.12 R1.2 40.06,17.47 ; 34.48,18.12 R6.2 ; 46.1,15.38 44.35,15.38 42.1,13.14 ; 46.1,15.38 46.1,17.11 C4.2 41.93,17.46 R7.2 40.06,17.47 ; 46.1,15.38 51.51,15.38 52.32,16.19 52.32,18.15 52.83,18.66 54.79,18.66 55.51,19.38 57.96,19.38 58.39,18.95 60.8,18.95 61.46,19.61 Q2.2 ; 43.85,8.61 38.34,8.61 37.37,7.64 U3.5 ; 43.85,8.61 44.47,8 U10.5 ; 27.04,18.12 R8.2 ; 27.04,18.12 23.98,18.12 R10.2 ; 28.09,30.03 U9.3 ; 28.09,30.03 16.15,30.03 ; U9.7 28.73,24.95 39.4,24.95 U8.7 40.06,24.32 ; 40.06,24.32 40.06,17.47 ; 16.15,30.03 U5.3 ; R3.2 30.86,13.19
+12V: length 152.5
  Top Layer w0.254: F1.2 13.98,20.32 15.22,21.56 34.14,21.56 v1(34.16,21.58) ; D2.1 66.8,13.46 66.8,34.28 60.92,40.16 K1.1 52.38,40.13 v1(48.01,40.13) 45.34,42.79 8.67,42.79 C1.1 4.63,38.75 4.63,31.63
  Bottom Layer w0.254: v1(48.01,40.13) 48.01,28.82 46.78,27.6 40.2,27.6 39.11,28.7 35.69,28.7 34.16,27.17 v1(34.16,21.58)
GND: length 259.3
  Top Layer w0.254: 4.44,21.83 3.82,21.83 3.05,22.6 3.05,27.75 4.63,29.33 5.59,29.33 7.37,31.11 7.37,37.84 9.14,39.62 C1.2 14.06,41.65 23.71,41.65 C2.2 25.49,39.87 38.6,39.87 CN1.3 40.1,36.9 43.94,33.06 43.94,30.35 44.89,29.4 U8.12 48.07,29.4 49,28.46 49,24.02 50.02,23 53.32,23 ; 4.44,21.83 LED1.1 8.38,27.41 U1.4 13.09,29.33 13.66,28.76 21.69,28.76 ; 4.44,21.83 D1.1 4.44,16.76 ; R18.1 R13.1 33.86,11.3 27.87,11.3 R17.1 26.17,10.54 25.53,9.91 25.53,6.36 ; 21.69,28.76 33,28.76 U9.12 ; 21.69,28.76 U5.12 ; 53.32,23 58.02,23 59.19,21.83 Q1.2 ; 53.32,23 Q3.2 ; R14.2 46.02,11.88 47.78,11.88 48.25,12.35 52.3,12.35 53.21,11.44 55.63,11.44 ; 25.53,6.36 24.5,5.33 U2.1 22.19,4.25 20.31,4.25 19.98,4.59 18.82,4.59 17.53,3.3 5.84,3.3 5.14,4 5.14,5.45 4.39,6.2 U6.4 4.03,10.53 3.05,11.52 3.05,15.36 4.44,16.76 ; 25.53,6.36 28.8,6.36 R12.1 30.27,4.89 U3.3 35.75,4.89 36.38,5.52 40.45,5.52 40.92,5.05 41.87,5.05 ; R4.2 20.7,13.13 20.7,17.87 R11.1 18.84,18.22 15.3,18.22 13.84,16.76 4.44,16.76 ; 55.63,11.44 55.63,6.98 54.79,6.15 43.71,6.15 42.62,5.05 41.87,5.05 ; 55.63,11.44 56.14,11.96 U7.3 ; 41.87,5.05 U10.3
V1: length 28.9
  Top Layer w0.254: R3.1 29.71,9.39 v1(26.29,9.39) ; v1(19.69,24.89) 20.39,25.59 21.69,25.59
  Bottom Layer w0.254: v1(19.69,24.89) 19.69,10.28 20.54,9.43 26.25,9.43 v1(26.29,9.39)
  vias: v1(19.62,10.54)
V2: length 44.7
  Top Layer w0.254: U2.2 18.67,5.33 17.9,6.09 17.9,9.9 17.26,10.54 R2.1 v1(15.34,10.54) ; v1(12.54,17.51) 11.31,17.51 10.41,18.41 10.41,23.36 11.37,24.32 U5.7 ; v1(16.15,26.46) U5.5
  Bottom Layer w0.254: v1(16.15,26.46) 16.15,19.7 13.97,17.52 12.55,17.52 v1(12.54,17.51) 12.54,11.69 13.69,10.54 v1(15.34,10.54)
MP: length 59.3
  Top Layer w0.254: U5.8 23.94,24.32 25.84,26.22 40.03,26.22 ; 40.03,26.22 40.03,25.59 40.08,25.59 v1(40.48,25.19) ; 40.03,26.22 U8.5 40.83,26.86 41.62,27.65 v1(41.62,28.82) ; R13.2 35.63,9.52 v1(40.51,9.52)
  Bottom Layer w0.254: v1(40.51,9.52) 40.48,9.56 v1(40.48,25.19) ; v1(41.62,28.82) 41.62,39.85 CN1.4
OP1: length 58.6
  Top Layer w0.254: U9.5 27.73,26.86 27.1,27.49 19.49,27.49 v1(19.43,27.55) 16.73,27.55 U5.4 15.18,28.13 14.73,27.68 14.73,25.39 15.17,24.95 18.29,24.95 19.55,23.69 25.1,23.69 26.99,25.59 28.09,25.59
  Bottom Layer w0.254: CN1.8 21.31,41.37 19.86,39.92 19.86,31.38 19.43,30.95 v1(19.43,27.55)
OP2: length 50.5
  Top Layer w0.254: v1(23.74,26.22) 16.99,26.22 16.79,26.02 16.79,25.82 16.39,25.82 16.15,25.59 ; v1(43.56,28.82) 43.62,28.76 46.78,28.76 47.12,28.42 47.12,27.19 46.78,26.86 U8.10 45.57,25.59
  Bottom Layer w0.254: 38.61,29.33 38.61,30.09 38.6,30.1 38.6,39.87 CN1.6 ; 38.61,29.33 35.31,29.33 32.2,26.22 v1(23.74,26.22) ; 38.61,29.33 39.37,29.33 40.64,28.06 42.8,28.06 v1(43.56,28.82)
SCIN: length 90.3
  Top Layer w0.254: CN1.2 46.12,38.35 61.47,38.35 66.17,33.65 66.17,15.49 63.81,13.13 63.81,10.48 64.26,10.03 66.08,10.03 67.44,11.38 67.44,34.92 60.19,42.16 K1.4
SCOUT: length 18.5
  Top Layer w0.254: CN1.1 44.01,37.46 51.18,37.46 52.42,36.22 K1.5
$1N80: length 32.1
  Top Layer w0.254: v1(32.26,20.95) 32.22,20.98 15.45,20.98 13.51,19.04 v1(12.32,19.04) ; R1.1 v1(36.56,18.97) ; v1(9.48,19) 8.39,20.09 LED1.2
  Bottom Layer w0.254: v1(32.26,20.95) 34.24,18.97 v1(36.56,18.97) ; v1(12.32,19.04) 12.28,19 v1(9.48,19)
$1N251: length 92.6
  Top Layer w0.254: v1(39.27,19.71) 35.22,19.71 R6.1 ; v1(38.74,6.22) 38.51,5.99 34.92,5.99 U3.2 ; U5.1 16.15,30.76 ; 16.15,30.76 v1(13.9,30.76) ; 16.15,30.76 U5.2
  Bottom Layer w0.254: v1(13.9,30.76) 13.9,19.1 12.94,18.15 8.63,18.15 7.42,16.94 7.42,3.88 7.98,3.31 38.03,3.31 38.74,4.02 v1(38.74,6.22) 39.27,6.75 v1(39.27,19.71)
$1N317: length 16.7
  Top Layer w0.254: v1(50.29,5.45) 45.04,5.45 U10.4
  Bottom Layer w0.254: v1(50.29,5.45) 50.29,8.76 51.69,10.15 55.41,10.15 v1(56.57,11.31)
$1N570: length 51.1
  Top Layer w0.254: K1.2 68.07,36.51 68.07,11.17 66.42,9.52 61.59,9.52 60.75,10.37 D2.2 61.34,12.4 v1(61.34,14.09) ; Q1.3 57.43,18.45 60.82,18.45 v1(61.29,17.99)
  Bottom Layer w0.254: v1(61.29,17.99) 61.29,14.15 v1(61.34,14.09)
$1N660: length 93.1
  Top Layer w0.254: 45.75,18.86 49.48,18.86 v1(49.53,18.92) ; Q3.1 v1(55.5,17.71) ; R17.2 27.5,12.43 v1(27.5,12.56)
  Bottom Layer w0.254: 50.67,22.15 50.67,38.92 46.55,43.05 36.79,43.05 35.86,42.11 35.86,38.15 34.66,36.95 28.32,36.95 22.99,31.62 22.99,25.9 27.5,21.39 v1(27.5,12.56) ; 50.67,22.15 49.53,21.01 v1(49.53,18.92) ; 50.67,22.15 54.42,22.15 55.5,21.07 v1(55.5,17.71)
$1N1894: length 47.9
  Top Layer w0.254: v1(22.23,17) 22.23,19.56 23.08,20.41 29.33,20.41 R5.1 ; U3.1 33.31,8.25 v1(27.18,8.25)
  Bottom Layer w0.254: v1(21.69,31.94) 21.72,31.91 21.72,17.52 v1(22.23,17) 25.22,17 26.86,15.36 26.86,10.46 27.12,10.2 27.12,8.31 v1(27.18,8.25)
$1N2001: length 25.4
  Top Layer w0.254: U7.1 56.41,10.5 v1(56.41,10.2) ; U3.4 38.2,4.06 v1(47.5,4.06)
  Bottom Layer w0.254: v1(47.5,4.06) 55.25,4.06 56.41,5.22 v1(56.41,10.2)
$1N4280: length 163.8
  Top Layer w0.254: Q1.1 57.19,15.73 56.06,15.73 ; 56.06,15.73 55.05,14.72 v1(47.86,14.72) ; 56.06,15.73 v1(56.06,15.75) ; v1(24.64,19.68) 26.33,19.68 R8.1 ; U6.7 13.72,13.08 14.22,12.57 v1(14.22,11.55)
  Bottom Layer w0.254: v1(24.64,19.68) 23.24,19.68 22.39,20.53 22.39,31.91 30.35,39.87 34.58,39.87 35.36,40.66 35.36,42.47 36.58,43.68 52.32,43.68 56.71,39.3 56.71,16.4 v1(56.06,15.75) ; v1(14.22,11.55) 15.49,11.55 18.57,8.48 23.31,8.48 24.55,7.23 27.56,7.23 28.7,8.38 37.21,8.38 37.76,8.92 37.76,24.67 38.86,25.78 47.12,25.78 47.86,25.04 v1(47.86,14.72)
$1N5487: length 146.3
  Top Layer w0.254: U4.1 50.66,11.49 v1(52.24,11.49) ; R11.2 17.82,15.69 8.27,15.69 7.37,14.78 7.37,12.3 6.87,11.81 U6.3 v1(4.39,11.41)
  Bottom Layer w0.254: v1(52.24,11.49) 55.72,11.49 60.54,16.31 60.54,42.44 58.79,44.19 6.22,44.19 4.39,42.36 v1(4.39,11.41)
$1N7549: length 84.9
  Top Layer w0.254: v1(9.69,8.28) 9.8,8.39 U6.5 ; R7.1 42.36,18.97 v1(42.59,18.74) ; v1(43.75,12.9) 44.71,13.86 57,13.86 58.01,12.85 58.01,5.8 55.53,3.32 27.83,3.32 ; 27.83,3.32 20.14,3.32 v1(19.51,3.95) ; 27.83,3.32 R12.2
  Bottom Layer w0.254: v1(19.51,3.95) 15.57,7.89 10.09,7.89 v1(9.69,8.28) ; v1(43.75,12.9) 43.75,17.58 v1(42.59,18.74)
$1N7655: length 115.5
  Top Layer w0.254: v1(23.37,19.04) 23.37,19.02 R10.1 ; Q2.1 63.44,17.71 58.63,12.9 58.63,5.41 55.88,2.66 v1(5.72,2.66) ; U6.1 4.46,14.28 v1(6.17,14.28) ; v1(25.26,22.63) 15.27,22.63 13.72,21.08 11.28,21.08 v1(11.12,21.24)
  Bottom Layer w0.254: v1(23.37,19.04) 25.01,19.04 25.26,19.3 v1(25.26,22.63) ; v1(5.72,2.66) 5.72,2.67 5.72,13.83 v1(6.17,14.28) 6.17,20.39 7.02,21.24 v1(11.12,21.24)
$1N14250: length 75.1
  Top Layer w0.254: v1(21.08,10.53) 23.36,10.53 R15.1 v1(23.37,7.36) ; v1(22.1,32.89) 27.14,32.89 U9.1 28.79,32.63 39.37,32.63 40.03,31.97 U8.1 U8.2 v1(42.93,30.67) ; U10.2 41.28,5.84 39.88,7.23 v1(38.48,7.23)
  Bottom Layer w0.254: v1(22.1,32.89) 21.59,32.89 21.08,32.38 v1(21.08,10.53) ; v1(38.48,7.23) 29.08,7.23 27.69,5.84 24,5.84 23.37,6.47 v1(23.37,7.36) ; v1(42.93,30.67) v1(45.57,30.67)
$1N14254: length 58.7
  Top Layer w0.254: U7.4 53.77,12.87 47.32,12.87 v1(47.08,12.64) ; R9.2 16.2,17.14 v1(18.09,17.14) ; v1(38.62,15.6) 39.35,16.32 v1(45.38,16.32) ; v1(18.71,9.37) 21.52,6.56 v1(24.62,6.56)
  Bottom Layer w0.254: v1(38.62,15.6) 38.62,8.9 37.62,7.9 29,7.9 27.66,6.56 v1(24.62,6.56) ; v1(47.08,12.64) 47.08,14.62 v1(45.38,16.32) ; v1(18.71,9.37) 18.71,16.52 v1(18.09,17.14)
$1N35655: length 56.3
  Top Layer w0.254: v1(38.35,28.06) 38.42,28.13 U8.4 39.4,27.49 28.73,27.49 U9.4 ; R18.2 38.63,10.82 42.1,10.82 ; v1(43.69,26.92) 43.69,25.14 44.51,24.32 U8.8 ; 42.1,10.82 R16.1 ; 42.1,10.82 43.02,10.82 v1(43.18,10.66)
  Bottom Layer w0.254: v1(43.18,10.66) 44.07,9.77 48.01,9.77 48.85,10.62 48.85,25.57 47.5,26.92 v1(43.69,26.92) 39.5,26.92 v1(38.35,28.06)
$1N35960: length 97.2
  Top Layer w0.254: v1(44.83,20.57) 49.41,20.57 Q3.3 51.32,16.93 v1(51.34,16.91) ; v1(44.96,8.76) v1(44.96,10.53) 44.97,10.54 R14.1 ; U6.6 11.56,11.81 12.06,11.3 12.06,4.82 11.3,4.06 v1(6.6,4.06) ; v1(57.02,14.98) 59.8,14.98 62.94,18.12 Q2.3 ; C5.2 12.07,5.45
  Bottom Layer w0.254: v1(51.34,16.91) 53.27,14.98 v1(57.02,14.98) ; v1(44.96,8.76) 44.96,3.68 44.2,2.92 7.31,2.92 6.6,3.63 v1(6.6,4.06) ; v1(44.96,10.53) 44.74,10.75 44.74,20.48 v1(44.83,20.57)
$1N36060: length 35
  Top Layer w0.254: v1(6.6,7.36) 6.6,7.09 8.1,5.59 ; R9.1 16.79,19.89 v1(17.74,19.89) ; 8.32,5.45 8.19,5.59 8.1,5.59 ; v1(6.6,12.9) 4.57,12.9 U6.2 ; 8.1,5.59 8.1,11.9 8.64,12.44 v1(13.33,12.44)
  Bottom Layer w0.254: v1(6.6,7.36) v1(6.6,12.9) ; v1(13.33,12.44) 15.49,12.44 16.64,13.59 16.64,18.8 v1(17.74,19.89)

## Copper pours and planes (outline as drawn; the poured copper is in the pictures)
12VIN on Bottom Layer: -1.52,49.27 71.25,49.27 71.25,-1.15 -1.52,-1.15
GND on Top Layer: -0.64,48.51 70.36,48.51 70.36,-0.51 -0.64,-0.51

Small or netless copper shapes (teardrops, artwork), in the pictures only: 253 on Top Layer, 88 on Bottom Layer

## Text on the board
Bottom Silkscreen Layer: OUT | IN
Top Silkscreen Layer: 12V | 5V | GND | SCOUT | OP1 | X | OP2 | MP | SCIN | POWER | BSPD 2023
